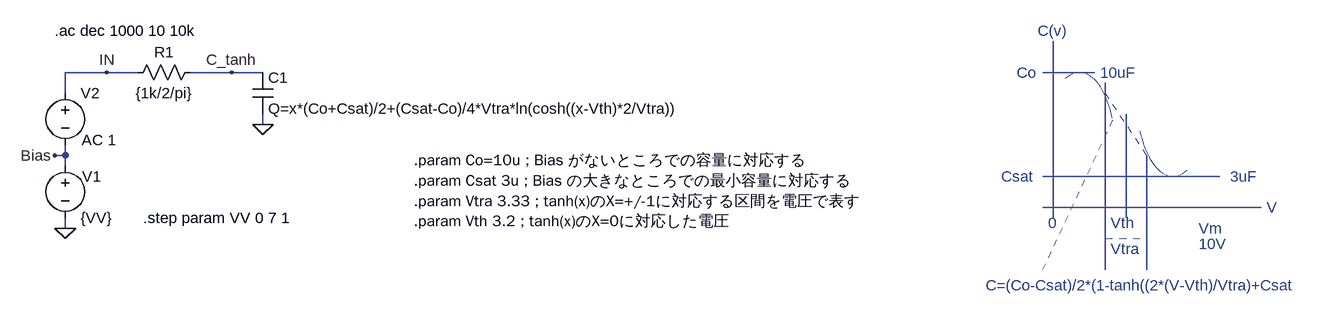
[diagram p0: schematic Fig_2-106_VdepndCap_tanh_AC.asc]
Fig_2-106_VdepndCap_tanh_AC.asc, the LTspice schematic file:
Version 4
SHEET 1 2076 680
WIRE 96 128 32 128
WIRE 144 128 96 128
WIRE 288 128 224 128
WIRE 336 128 288 128
WIRE 32 160 32 128
WIRE 336 208 336 192
WIRE 32 256 32 240
WIRE 32 256 16 256
WIRE 32 272 32 256
WIRE 32 368 32 352
FLAG 32 368 0
FLAG 336 208 0
FLAG 288 128 C_tanh
FLAG 16 256 Bias
FLAG 96 128 IN
SYMBOL voltage 32 256 R0
WINDOW 123 0 0 Left 0
WINDOW 39 0 0 Left 0
WINDOW 0 26 32 Left 2
SYMATTR InstName V1
SYMATTR Value {VV}
SYMBOL cap 320 128 R0
SYMATTR InstName C1
SYMATTR Value Q=x*(Co+Csat)/2+(Csat-Co)/4*Vtra*ln(cosh((x-Vth)*2/Vtra))
SYMBOL voltage 32 144 R0
WINDOW 3 20 98 Left 2
WINDOW 123 25 88 Left 2
WINDOW 39 0 0 Left 0
SYMATTR Value ""
SYMATTR Value2 AC 1
SYMATTR InstName V2
SYMBOL res 128 144 R270
WINDOW 0 32 56 VTop 2
WINDOW 3 0 56 VBottom 2
SYMATTR InstName R1
SYMATTR Value {1k/2/pi}
TEXT 152 352 Left 2 !.step param VV 0 7 1
TEXT 16 64 Left 2 !.ac dec 1000 10 10k
TEXT 568 264 Left 2 !.param Co=10u ; Bias がないところでの容量に対応する\n.param Csat 3u ; Bias の大きなところでの最小容量に対応する\n.param Vtra 3.33 ; tanh(x)のX=+/-1に対応する区間を電圧で表す\n.param Vth 3.2 ; tanh(x)のX=0に対応した電圧
TEXT 1624 128 Left 2 ;10uF
TEXT 1824 288 Left 2 ;3uF
TEXT 1528 64 Left 2 ;C(v)
TEXT 1880 336 Left 2 ;V
TEXT 1496 128 Left 2 ;Co
TEXT 1472 288 Left 2 ;Csat
TEXT 1776 368 Left 2 ;Vm
TEXT 1776 392 Left 2 ;10V
TEXT 1448 456 Left 2 ;C=(Co-Csat)/2*(1-tanh((2*(V-Vth)/Vtra)+Csat
TEXT 1640 400 Left 2 ;Vtra
TEXT 1640 360 Left 2 ;Vth
TEXT 1544 360 Left 2 ;0
LINE Normal 1552 352 1552 80
LINE Normal 1872 336 1536 336
LINE Normal 1696 256 1632 160 2
LINE Normal 1808 288 1536 288
LINE Normal 1696 432 1696 256
LINE Normal 1616 128 1536 128
LINE Normal 1536 432 1648 192 3
LINE Normal 1632 432 1632 144
LINE Normal 1664 352 1664 192
LINE Normal 1632 384 1696 384 3
ARC Normal 1536 368 1648 128 1703 139 1564 109 2
ARC Normal 1792 48 1680 288 1625 277 1764 307 2

The netlist it stands for:
* Fig_2-106_VdepndCap_tanh_AC.asc
V1 Bias 0 {VV}
C1 C_tanh 0 Q=x*(Co+Csat)/2+(Csat-Co)/4*Vtra*ln(cosh((x-Vth)*2/Vtra))
V2 IN Bias AC 1
R1 IN C_tanh {1k/2/pi}
.step param VV 0 7 1
.ac dec 1000 10 10k
.param Co=10u ; Bias がないところでの容量に対応する
.param Csat 3u ; Bias の大きなところでの最小容量に対応する
.param Vtra 3.33 ; tanh(x)のX=+/-1に対応する区間を電圧で表す
.param Vth 3.2 ; tanh(x)のX=0に対応した電圧
* 10uF
* 3uF
* C(v)
* V
* Co
* Csat
* Vm
* 10V
* C=(Co-Csat)/2*(1-tanh((2*(V-Vth)/Vtra)+Csat
* Vtra
* Vth
* 0
.backanno
.end